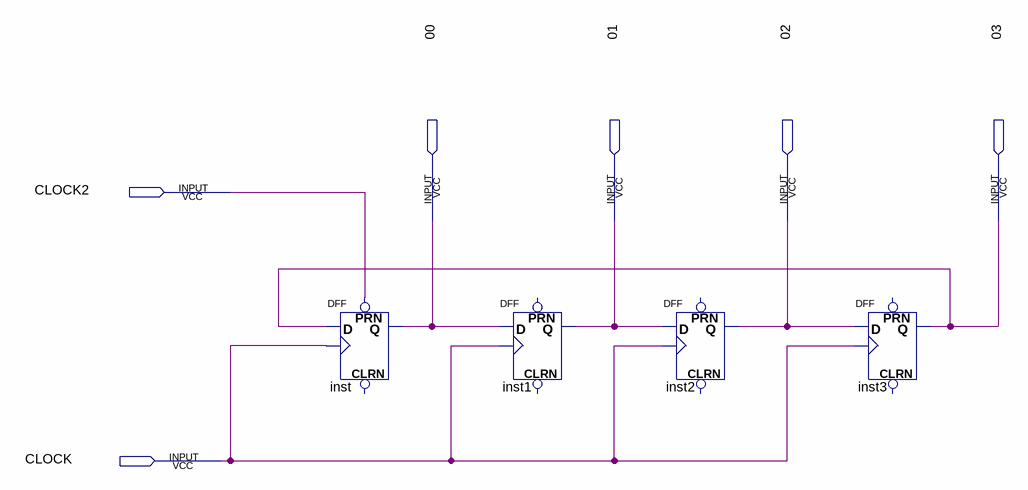
[diagram p0: schematic sheet]
// Quartus schematic anel.bdf as structural Verilog: 4 symbols, 6 pins
module anel (
  input  CLOCK2,
  input  \00 ,
  input  \01 ,
  input  \02 ,
  input  \03 ,
  input  CLOCK
);

  DFF inst (.CLK(CLOCK), .D(\03 ), .PRN(CLOCK2), .Q(\00 ));  // open: CLRN
  DFF inst1 (.CLK(CLOCK), .D(\00 ), .Q(\01 ));  // open: CLRN, PRN
  DFF inst2 (.CLK(CLOCK), .D(\01 ), .Q(\02 ));  // open: CLRN, PRN
  DFF inst3 (.CLK(CLOCK), .D(\02 ), .Q(\03 ));  // open: CLRN, PRN
endmodule
